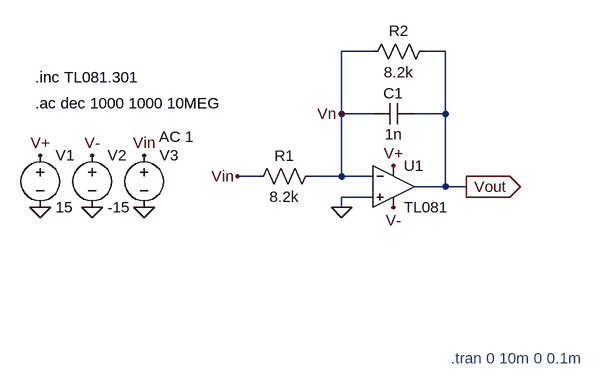
[diagram p0: schematic pasa_bajas.asc]
pasa_bajas.asc, the LTspice schematic file:
Version 4
SHEET 1 880 680
WIRE 496 -144 448 -144
WIRE 608 -144 576 -144
WIRE 448 -48 448 -144
WIRE 496 -48 448 -48
WIRE 608 -48 608 -144
WIRE 608 -48 560 -48
WIRE 320 48 288 48
WIRE 448 48 448 -48
WIRE 448 48 400 48
WIRE 496 48 448 48
WIRE 608 64 608 -48
WIRE 608 64 560 64
WIRE 640 64 608 64
WIRE 496 80 448 80
WIRE 448 96 448 80
FLAG -16 96 0
FLAG 64 96 0
FLAG 144 96 0
FLAG -16 16 V+
FLAG 64 16 V-
FLAG 144 16 Vin
FLAG 528 32 V+
FLAG 528 96 V-
FLAG 288 48 Vin
FLAG 448 96 0
FLAG 640 64 Vout
IOPIN 640 64 Out
FLAG 448 -48 Vn
SYMBOL voltage -16 0 R0
WINDOW 123 0 0 Left 0
WINDOW 39 0 0 Left 0
SYMATTR InstName V1
SYMATTR Value 15
SYMBOL voltage 64 0 R0
WINDOW 123 0 0 Left 0
WINDOW 39 0 0 Left 0
SYMATTR InstName V2
SYMATTR Value -15
SYMBOL voltage 144 0 R0
WINDOW 123 23 -13 Left 2
WINDOW 39 0 0 Left 0
WINDOW 3 24 152 Left 2
SYMATTR Value2 AC 1
SYMATTR Value ""
SYMATTR InstName V3
SYMBOL Opamps\\opamp2 528 0 R0
SYMATTR InstName U1
SYMATTR Value TL081
SYMBOL res 416 32 R90
WINDOW 0 0 56 VBottom 2
WINDOW 3 32 56 VTop 2
SYMATTR InstName R1
SYMATTR Value 8.2k
SYMBOL cap 560 -64 R90
WINDOW 0 0 32 VBottom 2
WINDOW 3 32 32 VTop 2
SYMATTR InstName C1
SYMATTR Value 1n
SYMBOL res 592 -160 R90
WINDOW 0 0 56 VBottom 2
WINDOW 3 32 56 VTop 2
SYMATTR InstName R2
SYMATTR Value 8.2k
TEXT -24 -104 Left 2 !.inc TL081.301
TEXT -24 -64 Left 2 !.ac dec 1000 1000 10MEG
TEXT 616 328 Left 2 ;.tran 0 10m 0 0.1m

The netlist it stands for:
* pasa_bajas.asc
V1 V+ 0 15
V2 V- 0 -15
V3 Vin 0 AC 1
XU1 0 Vn V+ V- Vout TL081  ; pins In+ In- V+ V- OUT
R1 Vn Vin 8.2k
C1 Vout Vn 1n
R2 Vout Vn 8.2k
.inc TL081.301
.ac dec 1000 1000 10MEG
* .tran 0 10m 0 0.1m
.backanno
.end